# EAGLE design transmisorPCB_2.0 (EAGLE 7.6.0)
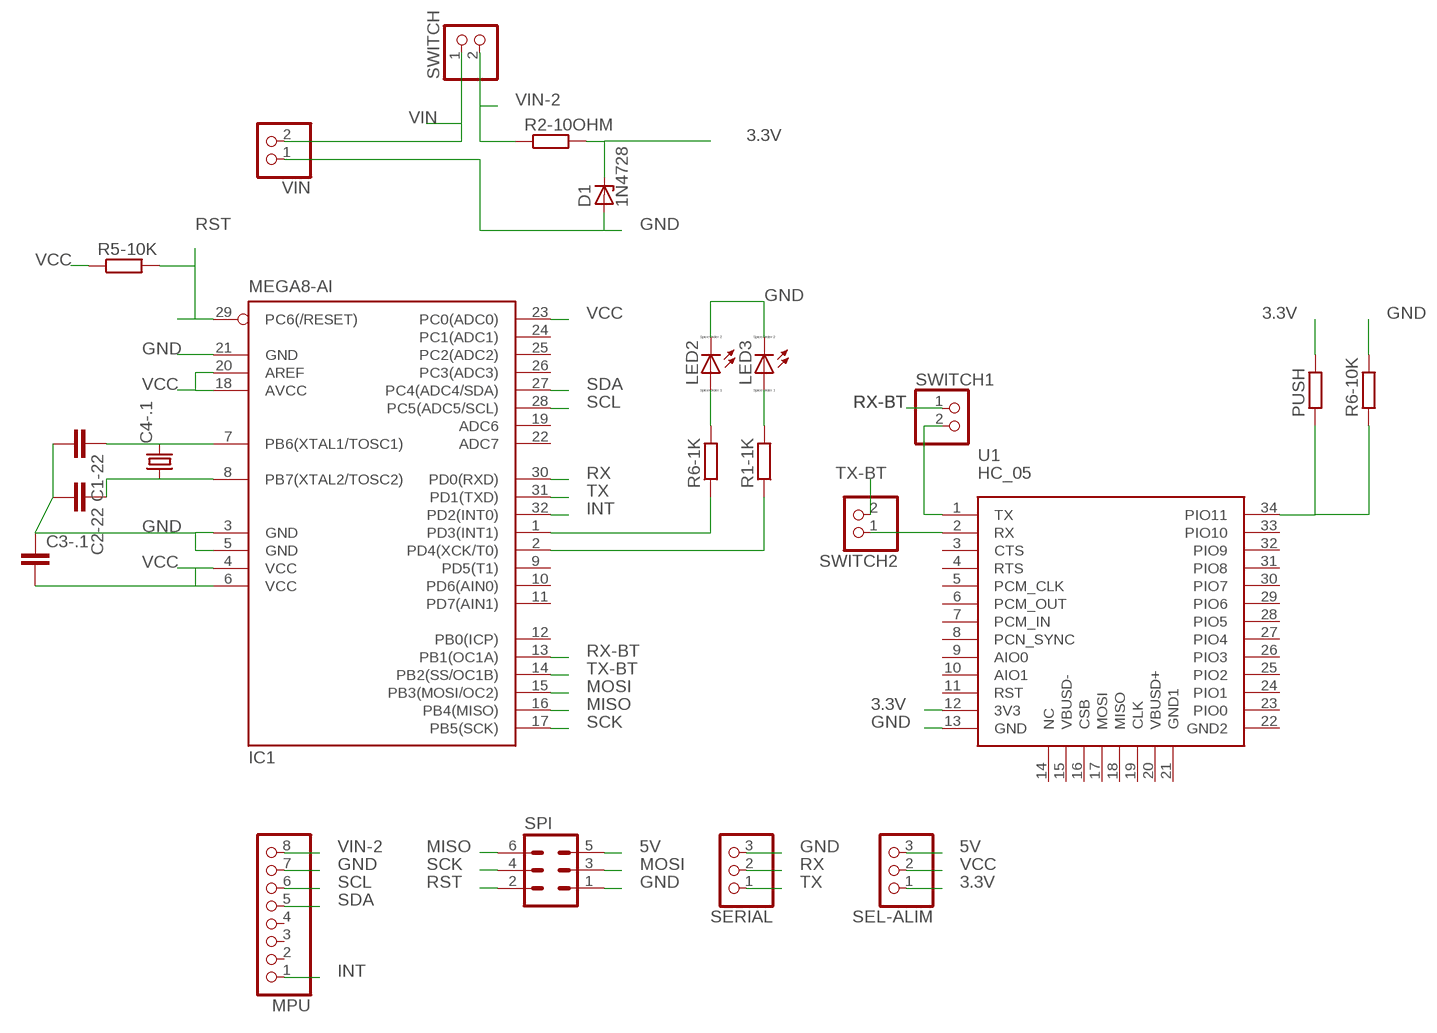
[diagram p0: schematic, sheet 1]

## Parts
C1-22  C-EUC0402K  [C0402K]
C2-22  C-EUC0402K  [C0402K]
C3-.1  C-EUC0402K  [C0402K]
C4-.1  CRYSTALHC49U70  [HC49U70]
D1  1N4728  [DO41Z10]
IC1  MEGA8-AI  [TQFP32-08]
LED2  LED_ESML0603  [LED_SML0603]
LED3  LED_ESML0603  [LED_SML0603]
MPU  PINHD-1X8  [1X08]
PUSH  R-EU_M2309  [M2309]
R1-1K  R-EU_M1206  [M1206]
R2-10OHM  R-EU_R2512  [R2512]
R5-10K  R-EU_M1206  [M1206]
R6-1K  R-EU_M1206  [M1206]
R6-10K  R-EU_M1206  [M1206]
SEL-ALIM  PINHD-1X3  [1X03]
SERIAL  PINHD-1X3  [1X03]
SPI  MA03-2  [MA03-2]
SWITCH  PINHD-1X2  [1X02]
SWITCH1  PINHD-1X2  [1X02]
SWITCH2  PINHD-1X2  [1X02]
U1  HC_05  [BLUETOOTH_SMD]
VIN  PINHD-1X2  [1X02]

## Nets
3.3V: D1.C PUSH.2 R2-10OHM.2 SEL-ALIM.1 U1.12(3V3)
5V: SEL-ALIM.3 SPI.5
GND: C1-22.2 C2-22.2 C3-.1.1 D1.A IC1.3(GND) IC1.5(GND) IC1.21(GND) LED2.C LED3.C MPU.7 R6-10K.2 SERIAL.3 SPI.1 U1.13(GND) VIN.1
INT: IC1.32(PD2(INT0)) MPU.1
MISO: IC1.16(PB4(MISO)) SPI.6
MOSI: IC1.15(PB3(MOSI/OC2)) SPI.3
N$1: IC1.2(PD4(XCK/T0)) R1-1K.1
N$2: SWITCH2.1 U1.2(RX)
N$3: C1-22.1 C4-.1.2 IC1.7(PB6(XTAL1/TOSC1))
N$4: C2-22.1 C4-.1.1 IC1.8(PB7(XTAL2/TOSC2))
N$5: IC1.1(PD3(INT1)) R6-1K.1
N$8: SWITCH1.2 U1.1(TX)
N$9: LED2.A R6-1K.2
N$10: LED3.A R1-1K.2
N$12: PUSH.1 R6-10K.1 U1.34(PIO11)
RST: IC1.29(PC6(/RESET)) R5-10K.2 SPI.2
RX: IC1.30(PD0(RXD)) SERIAL.2
RX-BT: IC1.13(PB1(OC1A)) SWITCH1.1
SCK: IC1.17(PB5(SCK)) SPI.4
SCL: IC1.28(PC5(ADC5/SCL)) MPU.6
SDA: IC1.27(PC4(ADC4/SDA)) MPU.5
TX: IC1.31(PD1(TXD)) SERIAL.1
TX-BT: IC1.14(PB2(SS/OC1B)) SWITCH2.2
VCC: C3-.1.2 IC1.4(VCC) IC1.6(VCC) IC1.18(AVCC) IC1.20(AREF) IC1.23(PC0(ADC0)) R5-10K.1 SEL-ALIM.2
VIN: SWITCH.1 VIN.2
VIN-2: MPU.8 R2-10OHM.1 SWITCH.2
Unconnected: IC1.9(PD5(T1)) IC1.10(PD6(AIN0)) IC1.11(PD7(AIN1)) IC1.12(PB0(ICP)) IC1.19(ADC6) IC1.22(ADC7) IC1.24(PC1(ADC1)) IC1.25(PC2(ADC2)) IC1.26(PC3(ADC3)) MPU.2 MPU.3 MPU.4 U1.3(CTS) U1.4(RTS) U1.5(PCM_CLK) U1.6(PCM_OUT) U1.7(PCM_IN) U1.8(PCN_SYNC) U1.9(AIO0) U1.10(AIO1) U1.11(RST) U1.14(NC) U1.15(VBUSD-) U1.16(CSB) U1.17(MOSI) U1.18(MISO) U1.19(CLK) U1.20(VBUSD+) U1.21(GND1) U1.22(GND2) U1.23(PIO0) U1.24(PIO1) U1.25(PIO2) U1.26(PIO3) U1.27(PIO4) U1.28(PIO5) U1.29(PIO6) U1.30(PIO7) U1.31(PIO8) U1.32(PIO9) U1.33(PIO10)

## Library data of the parts
C1-22 C2-22 C3-.1 = rcl:C-EU: CAPACITOR, European symbol
C4-.1 = crystal:CRYSTAL: CRYSTAL; OC_FARNELL: unknown; OC_NEWARK: unknown
D1 = diode:1N4728: Z DIODE 3.3 V, 1W, 5 percent
IC1 = atmel:MEGA8: MICROCONTROLLER 8 Kbytes FLASH, 1 kbytes SRAM, 512 bytes EEPROM, USART, 6-channel 10 bit ADC, 2-channel 8 bit ADC Pin compatible with Atmega48, ATMega88, ATMega168 Source: avr.lbr; MPN: ATMEGA8-16AU; OC_FARNELL: 9171371; OC_NEWARK: 73M8863
LED2 LED3 = eagle-ltspice:LED_E: LED Source: http://www.osram.convergy.de Source: www.luxeon.com Source: www.kingbright.com; SPICEMODEL: NONE; SPICEPREFIX: D; SPICETYPE: diode
MPU = pinhead:PINHD-1X8: PIN HEADER
PUSH R1-1K R5-10K R6-1K R6-10K = rcl:R-EU_: RESISTOR, European symbol
R2-10OHM = resistor:R-EU_: RESISTOR, European symbol
SEL-ALIM SERIAL = pinhead:PINHD-1X3: PIN HEADER
SPI = con-lstb:MA03-2: PIN HEADER; OC_FARNELL: unknown; OC_NEWARK: unknown
SWITCH SWITCH1 SWITCH2 VIN = pinhead:PINHD-1X2: PIN HEADER
U1 = Bluetooth HC-05:HC_05: HC-05 Bluetooth Module

## Board
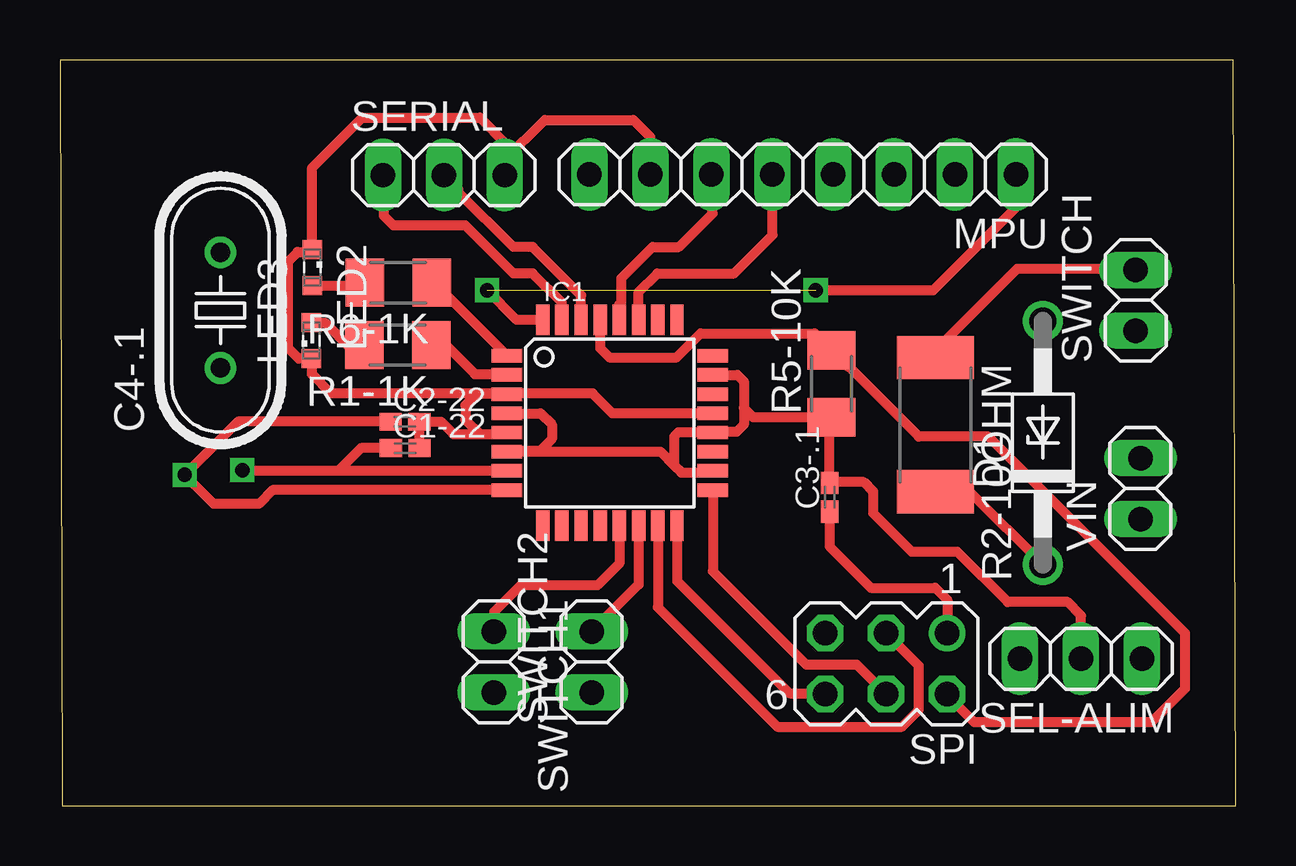
[diagram p1: board, top side]
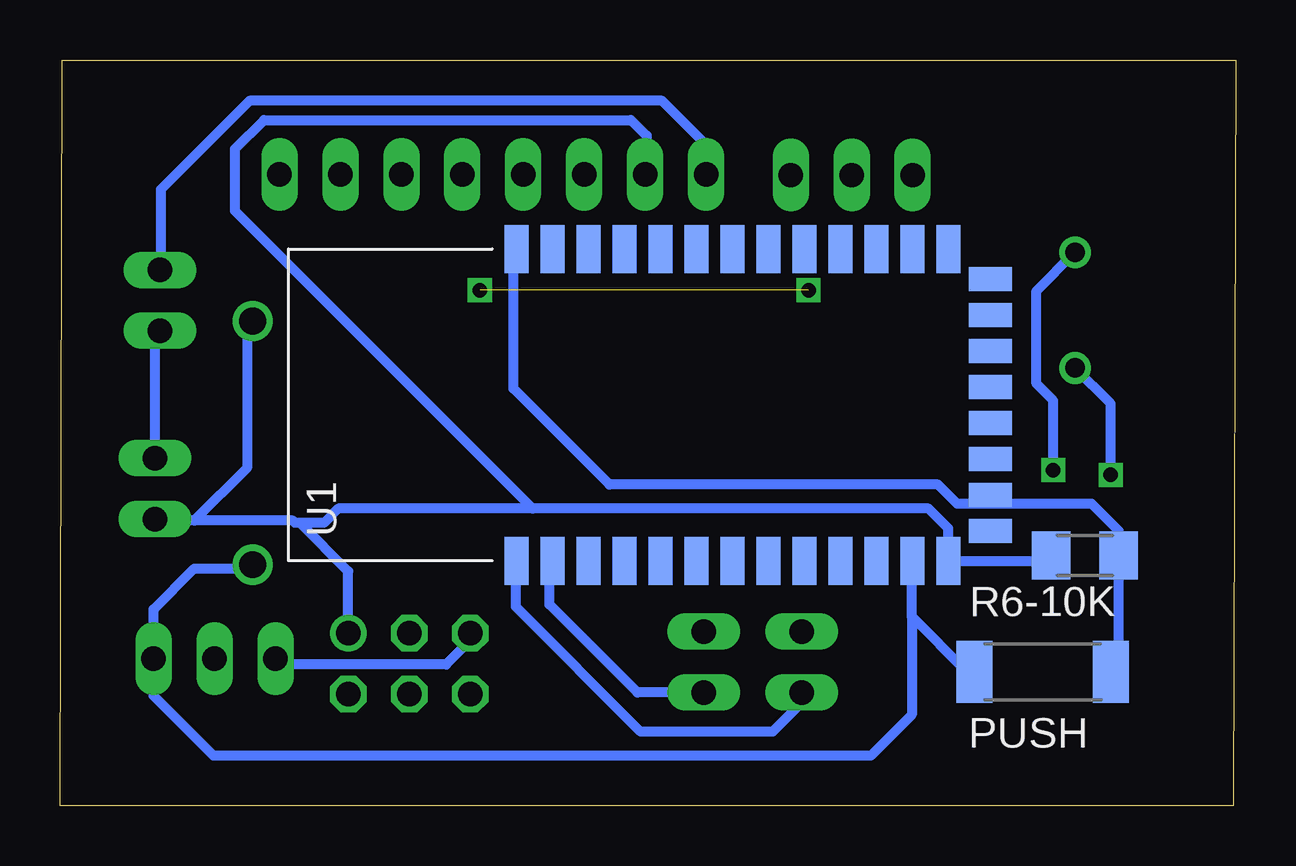
[diagram p2: board, bottom side, seen from below]

Size 49 x 31.1 mm. Coordinates in mm from the lower left corner, seen from the top.
Outline: 0.1,0 49,0 48.9,31.1 0,31.1 0.1,0
Copper layers (1*16): Top 0.035mm / dielectric 1.5mm / Bottom 0.035mm
Design rules "default": minimum track width 10mil, minimum drill 24mil, track to track 8mil, track to pad 8mil, pad to pad 8mil, via to via 8mil, smd to smd 8mil, copper to edge 40mil, drill to drill 8mil, minimum pad ring 10mil, minimum via ring 8mil, stop-mask expansion 4mil, vias tented up to drill 0mil, thermal gap 10mil

### Footprints (pad centres in the part's own frame; a part is rotated, then mirrored left to right if it is on the bottom)
C0402K = smd 0.925 x 0.74: 1 -0.6,0; 2 0.6,0
HC49U70 = drill 0.813: 1 -2.413,0; 2 2.413,0
DO41Z10 = drill 1.118: A 5.08,0; C -5.08,0
TQFP32-08 = smd 1.27 x 0.559: 1 -4.293,2.8; 2 -4.293,2; 3 -4.293,1.2; 4 -4.293,0.4; 5 -4.293,-0.4; 6 -4.293,-1.2; 7 -4.293,-2; 8 -4.293,-2.8; 17 4.293,-2.8; 18 4.293,-2; 19 4.293,-1.2; 20 4.293,-0.4; 21 4.293,0.4; 22 4.293,1.2; 23 4.293,2; 24 4.293,2.8 | smd 0.559 x 1.27: 9 -2.8,-4.293; 10 -2,-4.293; 11 -1.2,-4.293; 12 -0.4,-4.293; 13 0.4,-4.293; 14 1.2,-4.293; 15 2,-4.293; 16 2.8,-4.293; 25 2.8,4.293; 26 2,4.293; 27 1.2,4.293; 28 0.4,4.293; 29 -0.4,4.293; 30 -1.2,4.293; 31 -2,4.293; 32 -2.8,4.293
LED_SML0603 = smd 0.8 x 0.8: A 0.75,0; C -0.75,0
1X08 = drill 1.016 long: 1 -8.89,0; 2 -6.35,0; 3 -3.81,0; 4 -1.27,0; 5 1.27,0; 6 3.81,0; 7 6.35,0; 8 8.89,0
M2309 = smd 1.5 x 2.6: 1 -2.85,0; 2 2.85,0
M1206 = smd 1.6 x 2: 1 -1.4,0; 2 1.4,0
R2512 = smd 1.8 x 3.2: 1 -2.8,0; 2 2.8,0
1X03 = drill 1.016 long: 1 -2.54,0; 2 0,0; 3 2.54,0
MA03-2 = drill 1.016: 1 -2.54,-1.27 | drill 1.016 octagon: 2 -2.54,1.27; 3 0,-1.27; 4 0,1.27; 5 2.54,-1.27; 6 2.54,1.27
1X02 = drill 1.016 long: 1 -1.27,0; 2 1.27,0
BLUETOOTH_SMD = smd 2 x 1: 1 -6.35,3.81; 2 -6.35,2.31; 3 -6.35,0.81; 4 -6.35,-0.69; 5 -6.35,-2.19; 6 -6.35,-3.69; 7 -6.35,-5.19; 8 -6.35,-6.69; 9 -6.35,-8.19; 10 -6.35,-9.69; 11 -6.35,-11.19; 12 -6.35,-12.69; 13 -6.35,-14.19; 22 6.65,-14.19; 23 6.65,-12.69; 24 6.65,-11.19; 25 6.65,-9.69; 26 6.65,-8.19; 27 6.65,-6.69; 28 6.65,-5.19; 29 6.65,-3.69; 30 6.65,-2.19; 31 6.65,-0.69; 32 6.65,0.81; 33 6.65,2.31; 34 6.65,3.81 | smd 1 x 1.8: 14 -5.1,-15.94; 15 -3.6,-15.94; 16 -2.1,-15.94; 17 -0.6,-15.94; 18 0.9,-15.94; 19 2.4,-15.94; 20 3.9,-15.94; 21 5.4,-15.94

### Placement (x,y rotation side)
C1-22  14.39,14.92 0 top
C2-22  14.38,16.02 0 top
C3-.1  32.08,12.87 90 top
C4-.1  6.69,20.67 90 top
D1  40.97,15.14 90 top
IC1  22.92,15.97 0 top
LED2  10.52,22.45 270 top
LED3  10.48,19.4 90 top
MPU  30.96,26.33 180 top
PUSH  8.04,5.59 180 bottom
R1-1K  14.08,19.21 180 top
R2-10OHM  36.49,15.9 270 top
R5-10K  32.16,17.6 90 top
R6-1K  14.1,21.81 180 top
R6-10K  6.28,10.44 180 bottom
SEL-ALIM  42.56,6.14 180 top
SERIAL  16,26.3 0 top
SPI  34.44,5.93 180 top
SWITCH  44.84,21.08 90 top
SWITCH1  18.08,6 270 top
SWITCH2  22.16,6 90 top
U1  26.16,16.57 90 bottom
VIN  45.04,13.23 90 top

### Tracks (layer width: path | path; a pad name or v marks a point on that pad's centre or on a via)
3.3V
  Top 0.406: R2-10OHM.2 37.93,13.1 D1.C
  Bottom 0.406: PUSH.2 11.19,5.59 13.5,7.9 | 13.5,7.9 13.5,10.19 U1.12 | D1.C 41.13,9.9 43.4,9.9 45.1,8.2 SEL-ALIM.1 45.1,4.6 42.6,2.1 15.2,2.1 13.5,3.8 13.5,7.9
5V
  Bottom 0.406: SPI.5 31.9,6.9 32.9,5.9 39.78,5.9 SEL-ALIM.3
GND
  Top 0.406: IC1.21 23.03,16.37 22.2,17.2 18.66,17.2 | 18.66,17.2 IC1.3 17.37,17.17 16.9,16.7 16.9,16.1 17.5,15.5 | C1-22.2 C2-22.2 15.88,16.02 16.4,15.5 17.5,15.5 | 17.5,15.5 18.56,15.5 IC1.5 | 18.66,17.2 11.3,17.2 10.5,18 10.5,18.63 LED3.C 9.95,18.65 9.5,19.1 9.5,22.7 9.9,23.1 10.42,23.1 LED2.C 10.52,26.62 12.6,28.7 17.5,28.7 18.6,27.6 18.6,26.36 SERIAL.3 18.54,26.94 20.2,28.6 23.9,28.6 24.6,27.9 MPU.7 | C3-.1.1 32.08,10.82 33.8,9.1 36.48,9.1 36.98,8.6 SPI.1
  Bottom 0.406: R6-10K.2 7.9,10.22 U1.13 11.97,11.57 12.8,12.4 29.3,12.4 | 43.4,11.9 39.3,11.9 39.2,11.8 39,11.8 | 43.4,11.9 44.98,11.9 VIN.1 | 29.3,12.4 37.4,12.4 38,11.8 39,11.8 | D1.A 41.2,20 41.2,14.1 43.4,11.9 | 29.3,12.4 41.7,24.8 41.7,27.4 40.5,28.6 25.2,28.6 24.55,27.95 24.55,26.39 MPU.7 | SPI.1 36.98,9.78 39,11.8
INT  (via drill 0.6)  (1 unrouted)
  Top 0.406: IC1.32 19.04,20.26 v17.8,21.5 | v31.5,21.5 36.4,21.5 39.8,24.9 39.8,26.28 MPU.1
MISO
  Top 0.406: IC1.16 25.72,9.38 30.4,4.7 31.86,4.7 SPI.6
MOSI
  Top 0.406: IC1.15 24.92,8.28 29.9,3.3 35.1,3.3 35.8,4 35.8,5.84 SPI.3
N$1
  Top 0.406: R1-1K.1 16.09,19.21 17.3,18 18.6,18 IC1.2
N$2
  Bottom 0.406: SWITCH2.1 24.93,4.73 28.6,8.4 28.6,10.09 U1.2
N$3  (via drill 0.6)
  Top 0.406: IC1.7 11.6,13.97 | 11.6,13.97 7.63,13.97 v7.6,14 | C1-22.1 12.55,14.92 11.6,13.97
  Bottom 0.406: v7.6,14 7.6,16.9 8.3,17.6 8.3,21.47 C4-.1.2
N$4  (via drill 0.6)
  Top 0.406: IC1.8 8.87,13.17 8.3,12.6 6.4,12.6 v5.2,13.8 7.42,16.02 C2-22.1
  Bottom 0.406: v5.2,13.8 5.2,16.77 C4-.1.1
N$5
  Top 0.406: R6-1K.1 15.59,21.81 IC1.1
N$8
  Bottom 0.406: SWITCH1.2 18.08,4.32 19.3,3.1 24.8,3.1 30,8.3 30,10.19 U1.1
N$9
  Top 0.406: LED2.A 12.59,21.7 R6-1K.2
N$10
  Top 0.406: LED3.A 11.05,20.15 12.1,19.1 12.57,19.1 R1-1K.2
N$12
  Bottom 0.406: U1.34 30.1,23.09 30.1,17.4 26.1,13.4 12.4,13.4 11.6,12.6 6,12.6 4.88,11.48 R6-10K.1 4.88,5.9 PUSH.1
RST
  Top 0.406: IC1.29 22.52,19.08 22.9,18.7 25.7,18.7 26.7,19.7 31.46,19.7 R5-10K.2 32.86,18.3 32.9,18.3 35.8,15.4 38.7,15.4 46.9,7.2 46.9,4.9 45.5,3.5 38.1,3.5 36.98,4.62 SPI.2
RX
  Top 0.406: IC1.30 21.72,21.28 19.7,23.3 18.9,23.3 16.6,25.6 16.6,25.7 SERIAL.2
RX-BT
  Top 0.406: IC1.13 23.32,10.12 22.4,9.2 19.2,9.2 18.1,8.1 18.1,7.29 SWITCH1.1
SCK
  Top 0.406: IC1.17 27.21,9.79 31.1,5.9 33.2,5.9 SPI.4
SCL
  Top 0.406: IC1.28 23.32,20.92 23.4,21 23.4,22 24.7,23.3 25.8,23.3 27.2,24.7 27.2,26.28 MPU.6
SDA
  Top 0.406: IC1.27 24.12,21.42 24.9,22.2 28.1,22.2 29.7,23.8 MPU.5
TX
  Top 0.406: IC1.31 20.92,20.98 19.7,22.2 18.9,22.2 16.9,24.2 13.9,24.2 13.5,24.6 13.5,26.26 SERIAL.1
TX-BT
  Top 0.406: IC1.14 24.12,9.23 SWITCH2.2
VCC
  Top 0.406: IC1.23 28.23,17.97 28.5,17.7 28.5,16.6 | 28.5,16.6 28.5,15.9 28.2,15.6 27.24,15.6 IC1.20 25.77,15.57 25.6,15.4 25.6,14.2 | 25.6,14.2 25.9,13.9 27.14,13.9 IC1.18 | IC1.4 20.03,16.37 20.5,15.9 20.5,15.3 20,14.8 18.66,14.8 IC1.6 25.03,14.77 25.6,14.2 | 28.5,16.6 28.9,16.2 R5-10K.1 32.08,16.12 C3-.1.2 32.11,13.5 33.5,13.5 33.9,13.1 33.9,12.2 35.5,10.6 37.4,10.6 39.5,8.5 42,8.5 42.56,7.94 SEL-ALIM.2
VIN
  Bottom 0.406: VIN.2 45.04,19.61 SWITCH.1
VIN-2
  Top 0.406: R2-10OHM.1 36.49,18.99 39.9,22.4 44.79,22.4 SWITCH.2
  Bottom 0.406: MPU.8 22.07,27.57 23.9,29.4 41.1,29.4 44.8,25.7 44.8,22.39 SWITCH.2